# Altium schematic sheet CSM32RV20_TSSOP20_V1.1.SchDoc
size A4
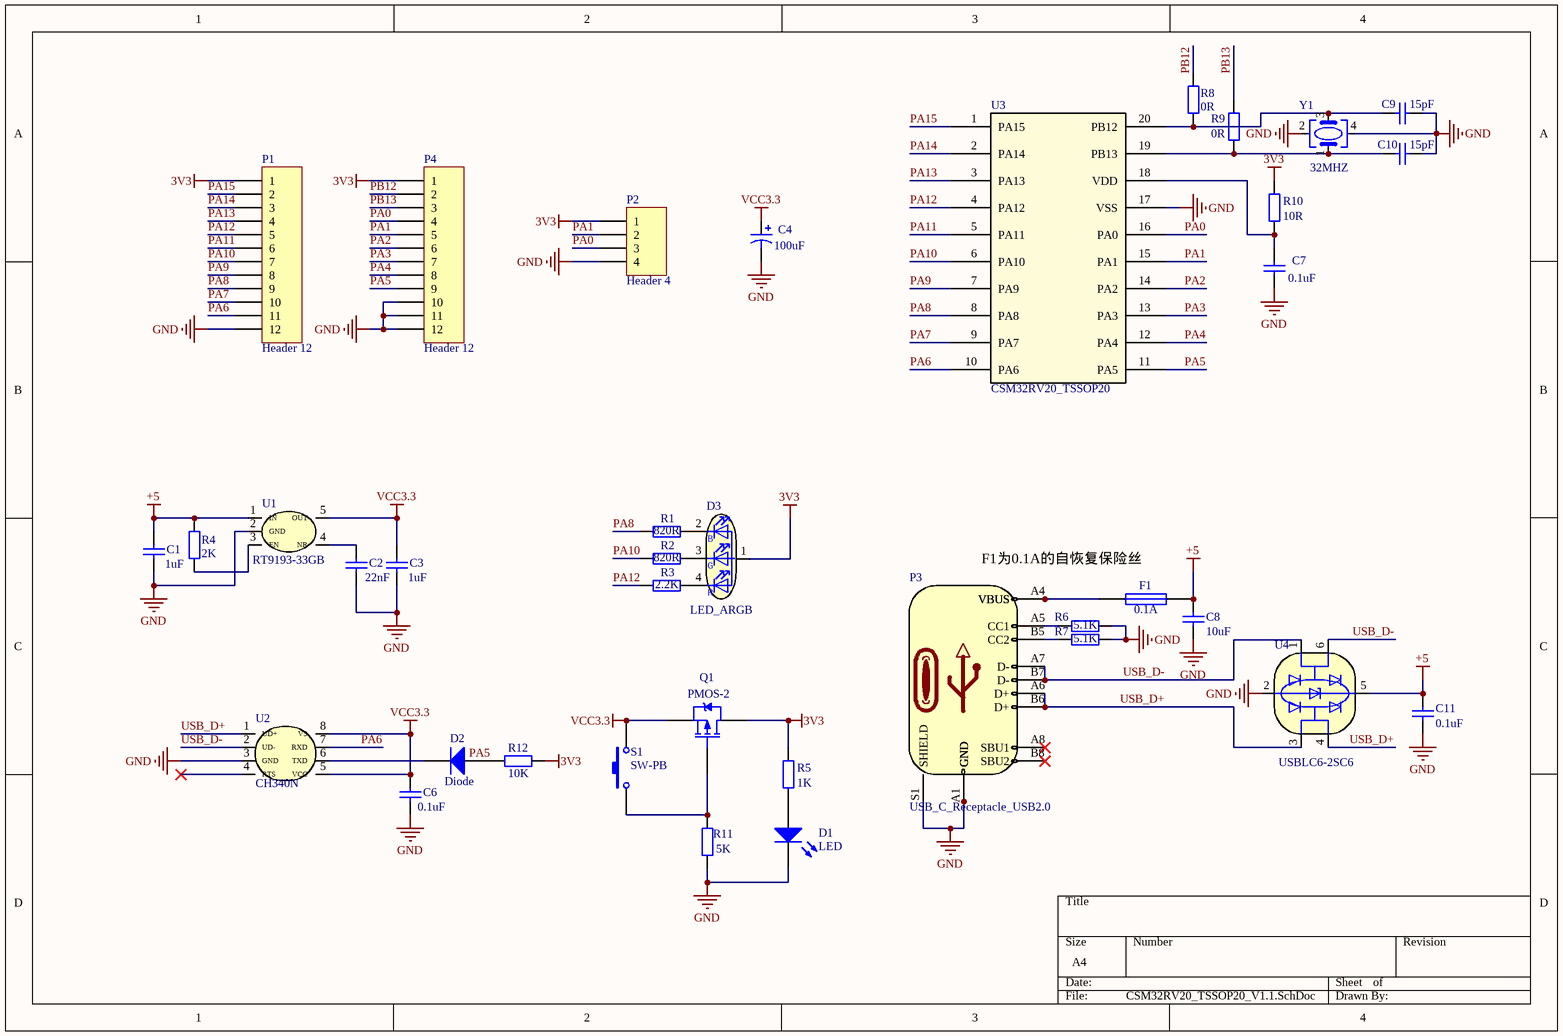
[diagram p0: CSM32RV20_TSSOP20_V1.1.SchDoc]

## Parts
C1  1uF  [0402]
C2  22nF  [0402]
C3  1uF  [0402]
C4  100uF  [C1210]
C6  0.1uF  [0402]
C7  0.1uF  [0402]
C8  10uF  [0402]
C9  15pF  [0402]
C10  15pF  [0402]
C11  0.1uF  [0402]
D1  LED  [LED 0402]
D2  Diode  [D_SOD-123]
D3  LED_ARGB  [LED_RGB_1210]
F1  0.1A  [C0805]
P1  Header 12  [HDR1X12]
P2  Header 4  [HDR1X4]
P3  USB_C_Receptacle_USB2.0  [USB-C-SMD_KH-TYPE-C-16P]
P4  Header 12  [HDR1X12]
Q1  PMOS-2  [SOT-23]
R1  820R  [0402]
R2  820R  [0402]
R3  2.2K  [0402]
R4  2K  [0402]
R5  1K  [0402]
R6  5.1K  [0402]
R7  5.1K  [0402]
R8  0R  [0402]
R9  0R  [0402]
R10  10R  [0402]
R11  5K  [0402]
R12  10K  [0402]
S1  SW-PB  [SW_PUSH_SPST_NO_ALPS_SKRK]
U1  RT9193-33GB  [SOT-23-5]
U2  CH340N  [SOP-8-1EP_6X5MM_P1.27MM]
U3  CSM32RV20_TSSOP20  [CSM32RV20_TSSOP20]
U4  USBLC6-2SC6  [SOT-23-6]
Y1  32MHZ  [CRYSTAL_SMD_3225-4PIN_3.2X2.5MM]

## Nets
3V3: D3.1(A) P1.1 P2.1 P4.1 Q1.3(D) R5.2 R10.2 R12.2
+5: C1.2 C8.2 C11.2 F1.2 R4.2 U1.1(IN) U4.5(VBUS)
GND: C1.1 C2.1 C3.1 C4.2 C6.1 C7.1 C8.1 C9.2 C10.2 C11.1 D1.2(K) P1.12 P2.4 P3.A1(GND) P3.A12(GND) P3.B1(GND) P3.B12(GND) P3.S1(SHIELD) P4.10 P4.11 P4.12 R6.2 R7.2 R11.1 U1.2(GND) U2.3(GND) U3.17(VSS) U4.2(GND) Y1.2 Y1.4
VCC3.3: C3.2 C4.1 C6.2 Q1.2(S) S1.2 U1.5(OUT) U2.5(VCC) U2.8(V3)
PA0: P2.3 P4.4 U3.16(PA0)
PA1: P2.2 P4.5 U3.15(PA1)
PA2: P4.6 U3.14(PA2)
PA3: P4.7 U3.13(PA3)
PA4: P4.8 U3.12(PA4)
PA5: D2.1(A) P4.9 R12.1 U3.11(PA5)
PA6: P1.11 U2.7(RXD) U3.10(PA6)
PA7: P1.10 U3.9(PA7)
PA8: P1.9 R1.1 U3.8(PA8)
PA9: P1.8 U3.7(PA9)
PA10: P1.7 R2.1 U3.6(PA10)
PA11: P1.6 U3.5(PA11)
PA12: P1.5 R3.1 U3.4(PA12)
PA13: P1.4 U3.3(PA13)
PA14: P1.3 U3.2(PA14)
PA15: P1.2 U3.1(PA15)
PB12: P4.2 R8.2
PB13: P4.3 R9.2
USB_D+: P3.A6(D+) P3.B6(D+) U2.1(UD+) U4.3(I/O2) U4.4(I/O2)
USB_D-: P3.A7(D-) P3.B7(D-) U2.2(UD-) U4.1(I/O1) U4.6(I/O1)
NetC2_2: C2.2 U1.4(NR)
NetC7_2: C7.2 R10.1 U3.18(VDD)
NetC9_1: C9.1 R8.1 U3.20(PB12) Y1.3
NetC10_1: C10.1 R9.1 U3.19(PB13) Y1.1
NetD1_1: D1.1(A) R5.1
NetD2_2: D2.2(K) U2.6(TXD)
NetD3_2: D3.2(RK) R1.2
NetD3_3: D3.3(GK) R2.2
NetD3_4: D3.4(BK) R3.2
NetF1_1: F1.1 P3.A4(VBUS) P3.A9(VBUS) P3.B4(VBUS) P3.B9(VBUS)
NetP3_A5: P3.A5(CC1) R6.1
NetP3_B5: P3.B5(CC2) R7.1
NetQ1_1: Q1.1(G) R11.2 S1.1
NetR4_1: R4.1 U1.3(EN)

Not connected (* = marked no-connect by the designer): P3 A8(SBU1)* B8(SBU2)*; U2 4(RTS)*

## Notes on the sheet
- (near P3) F1为0.1A的自恢复保险丝
- (in symbol LED_ARGB) B; G; R

## Library data of the parts
C1-C3 C6-C11 = Cap: Capacitor; Published: 8-Jun-2000; LatestRevisionDate: 17-Jul-2002; LatestRevisionNote: Re-released for DXP Platform.; PackageReference: RAD-0.3; Publisher: Altium Limited; PackageDescription: Radial Cap, Thru-Hole; 2 Leads; 0.3 in Pin Spacing; Comment_1: Cap
C4 = Cap Pol3: Polarized Capacitor (Surface Mount); Published: 8-Jun-2000; LatestRevisionDate: 29-May-2009; LatestRevisionNote: IPC-7351 Footprint Added.; PackageReference: C0805; Publisher: Altium Limited; PackageDescription: Chip Capacitor; Comment_1: Cap Pol3
D1 = LED0: Typical INFRARED GaAs LED; Published: 8-Jun-2000; LatestRevisionDate: 08-Jul-2005; LatestRevisionNote: Mech Layer 1 removed.; PackageReference: LED-0; Publisher: Altium Limited; PackageDescription: LED; 2 Leads
D2 = Diode: Default Diode; Published: 8-Jun-2000; LatestRevisionDate: 17-Jul-2002; LatestRevisionNote: Re-released for DXP Platform.; PackageVersion: Sep-1996; PackageReference: SMC; Publisher: Altium Limited; PackageDescription: DO-214-AB/SMC; 2 C-Bend Leads; Body 7.9 x 5.9 mm, inc. leads (LxW); Code_JEDEC: DO-214-AB
F1 = Fuse 1: Fuse; Published: 8-Jun-2000; LatestRevisionDate: 17-Jul-2002; LatestRevisionNote: Re-released for DXP Platform.; PackageReference: PIN-W2/E2.8; Publisher: Altium Limited; PackageDescription: Thru-Hole; 2 Leads
P1 P4 = Header 12: Header, 12-Pin; LatestRevisionDate: 17-Jul-2002; LatestRevisionNote: Re-released for DXP Platform.; Publisher: Altium Limited
P2 = Header 4: Header, 4-Pin; LatestRevisionDate: 17-Jul-2002; LatestRevisionNote: Re-released for DXP Platform.; Publisher: Altium Limited
Q1 = PMOS-2: P-Channel Power MOSFET; Note: Pin 4 not drawn and electrically connected to Pin 2.; Published: 8-Jun-2000; LatestRevisionDate: 17-Jul-2002; LatestRevisionNote: Re-released for DXP Platform.; DatasheetVersion: PD-9.390D; PackageVersion: Feb-1997; PackageReference: TO-220AB; Publisher: Altium Limited; PackageDescription: TO, Thru-Hole, Vertical, Heatsink Mounted; 3 In-Line Leads; Pitch 2.54 mm; ComponentLink1Description: Manufacturer Link; ComponentLink1URL: http://www.irf.com/
R1-R12 = Res2: Resistor; Published: 8-Jun-2000; LatestRevisionDate: 17-Jul-2002; LatestRevisionNote: Re-released for DXP Platform.; PackageReference: AXIAL-0.4; Publisher: Altium Limited; PackageDescription: Axial Device, Thru-Hole; 2 Leads; 0.4 in Pin Spacing; Comment_1: Res2
S1 = SW-PB: Switch; Published: 24-Mar-1999; LatestRevisionDate: 17-Jul-2002; LatestRevisionNote: Re-released for DXP Platform.; PackageReference: SPST-2; Publisher: Altium Limited; PackageDescription: Switch; 2 Leads
U3 = CSM32RV20_TSSOP20_1
Y1 = Crystal
P3 = USB_C_Receptacle_USB2.0: Datasheet: https://www.usb.org/sites/default/files/documents/usb_type-c.zip
U4 = USBLC6-2SC6: Datasheet: https://www.st.com/resource/en/datasheet/usblc6-2.pdf